# Altium project Limit_Switch_RGB_Vertical_v1.0.PrjPcb
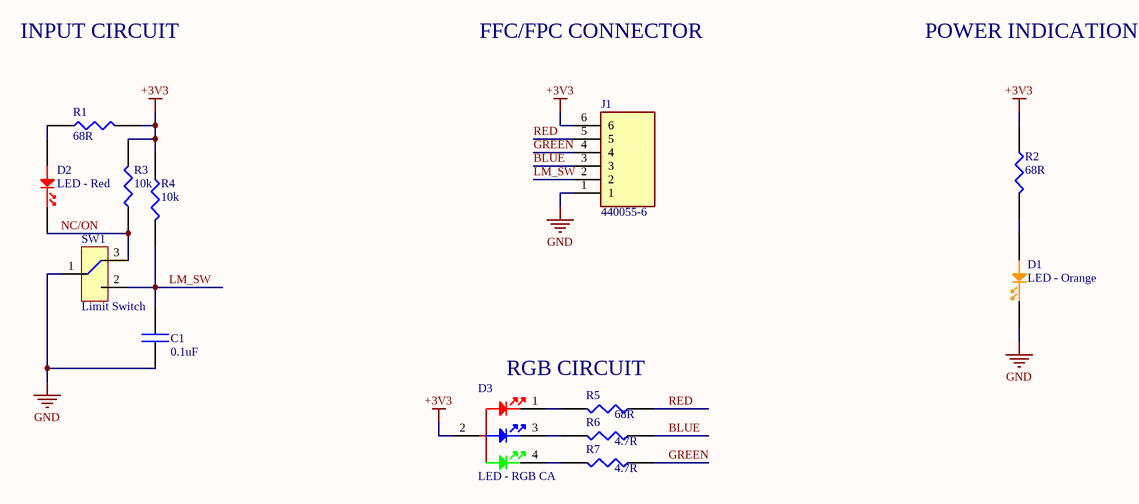
[diagram p0: Limit_Switch_RGB_Vertical_v1.0.SchDoc]
1 sheet, 13 parts. Net scope: global (net labels, ports and power ports of the same name join across sheets).
Board file: Limit_Switch_RGB_Vertical_v1.0.PcbDoc

## Sheet Limit_Switch_RGB_Vertical_v1.0.SchDoc
size A4

### Parts
C1  0.1uF  [0.1uF 0603]
D1  LED - Orange  [LED0603-Orange]
D2  LED - Red  [LED RED 0603]
D3  LED - RGB CA  [LED RGB CA 3528]
J1  440055-6  [TE_440055-6]
R1  68R  [68R 0603]
R2  68R  [68R 0603]
R3  10k  [10k R0603]
R4  10k  [10k R0603]
R5  68R  [68R 0603]
R6  4.7R  [4.7R 0603]
R7  4.7R  [4.7R 0603]
SW1  Limit Switch  [LimitSwitch Horizontal]

### Nets
+3V3: D3.2(Anode) J1.6 R1.2 R2.1 R3.2 R4.1
GND: C1.1 D1.1(Cathode) J1.1 SW1.1(C)
BLUE: J1.3 R6.1
GREEN: J1.4 R7.1
LM_SW: C1.2 J1.2 R4.2 SW1.2(NO)
NC/ON: D2.2(Cathode) R3.1 SW1.3(NC)
RED: J1.5 R5.1
NetD1_2: D1.2(Anode) R2.2
NetD2_1: D2.1(Anode) R1.1
NetD3_1: D3.1(Red) R5.2
NetD3_3: D3.3(Blue) R6.2
NetD3_4: D3.4(Green) R7.2

### Notes on the sheet
- INPUT CIRCUIT
- FFC/FPC CONNECTOR
- POWER INDICATION
- RGB CIRCUIT

### Library data of the parts
C1 = C0603C104M4RACTU: CAP CER 0.1UF 16V X7R 0603; Manufacturer: KEMET; Dielectric Material: Ceramic; Capacitance: 100nF; Tolerance: 20%; Supplier 1: Digi-Key; Supplier Part Number 1: 399-1099-1-ND; Manufacturer Part Number: C0603C104M4RACTU; RoHS: Yes; Category: Ceramic Capacitors; Stock 1: 114153; Pricing 1: 1=0.10000, 10=0.03100, 50=0.01720, 100=0.01400, 500=0.01002, 1000=0.00787 (USD); Mount: Surface Mount,PCB; Case/Package: 0603; Number of Pins: 2; Case Code (Metric): 1608; Case Code (Imperial): 0603; Min Operating Temperature: -55°C; Max Operating Temperature: 125°C; Package Quantity: 1; Voltage Rating: 16V; Packaging: Tape and Reel; Voltage Rating (DC): 16V; Dielectric: X7R; Termination: SMD/SMT; Length: 1.6mm; Height: 0.8mm; Width: 0.031inch; Thickness: 0.034inch; Lead Pitch: 0.7mm; Depth: 0.8mm; Radiation Hardening: No; REACH SVHC: No SVHC; ComponentLink1URL: https://datasheet.ciiva.com/18102/getdatasheetpartid-66190-18102310.pdf?src-supplier=Verical; ComponentLink1Description: https://datasheet.ciiva.com/18102/getdatasheetpartid-66190-18102310.pdf?src-supplier=Verical; ComponentLink2URL: https://datasheet.ciiva.com/7823/kem-c1002-x7r-smd-7823992.pdf?src-supplier=Element14; ComponentLink2Description: https://datasheet.ciiva.com/7823/kem-c1002-x7r-smd-7823992.pdf?src-supplier=Element14; ComponentLink3URL: https://datasheet.ciiva.com/7823/kem-c1002-x7r-smd-7823993.pdf?src-supplier=Element14; ComponentLink3Description: https://datasheet.ciiva.com/7823/kem-c1002-x7r-smd-7823993.pdf?src-supplier=Element14; ComponentLink4URL: https://datasheet.ciiva.com/14589/70095383-14589450.pdf?src-supplier=Allied+Electronics; ComponentLink4Description: https://datasheet.ciiva.com/14589/70095383-14589450.pdf?src-supplier=Allied+Electronics; ComponentLink5URL: https://datasheet.ciiva.com/18192/getdatasheetpartid-302288-18192716.pdf?src-supplier=Verical; ComponentLink5Description: https://datasheet.ciiva.com/18192/getdatasheetpartid-302288-18192716.pdf?src-supplier=Verical
D1 = LTST-C191KFKT: LED ORANGE CLEAR SMD; Manufacturer: Vishay Lite-On; Lens Color: Colorless; Wavelength: 611nm; Number of LEDs: 1; Viewing Angle: 130°; Lens Style: Diffused,Colorless,Rectangular; Luminous Intensity: 90mcd; Forward Current: 30mA; Forward Voltage: 2V; Power Rating: 75mW; Reverse Voltage: 5V; Dominant Wavelength: 605nm; Test Current: 20mA; Supplier 1: Digi-Key; Supplier Part Number 1: 160-1445-1-ND; Manufacturer Part Number: LTST-C191KFKT; RoHS: Yes; Category: LEDs; Stock 1: 92562; Pricing 1: 1=0.24000, 10=0.17900, 100=0.08460, 500=0.05640, 1000=0.04418, 2500=0.04324 (USD); Mount: Surface Mount; Case/Package: 0603; Number of Pins: 2; Case Code (Metric): 1608; Color: Orange; Case Code (Imperial): 0603; Min Operating Temperature: -55°C; Max Operating Temperature: 85°C; Package Quantity: 1; Packaging: Tape and Reel; Illumination Color: Orange; Lens Transparency: Clear; Number of Elements: 1; Power Dissipation: 75mW; Length: 1.6mm; Height: 0.55mm; Width: 0.8mm; Depth: 0.8mm; Radiation Hardening: No; Lead Free: Lead Free; ComponentLink1URL: https://datasheet.ciiva.com/2109/ltst-c191kfkt-2109968.pdf?src-supplier=Digi-Key; ComponentLink1Description: https://datasheet.ciiva.com/2109/ltst-c191kfkt-2109968.pdf?src-supplier=Digi-Key; ComponentLink2URL: https://datasheet.ciiva.com/12400/100-ltst-c191kfkt-39904-12400811.pdf?src-supplier=Mouser; ComponentLink2Description: https://datasheet.ciiva.com/12400/100-ltst-c191kfkt-39904-12400811.pdf?src-supplier=Mouser; ComponentLink3URL: https://datasheet.ciiva.com/11775/0900766b80dc02b0-11775613.pdf?src-supplier=RSComponents; ComponentLink3Description: https://datasheet.ciiva.com/11775/0900766b80dc02b0-11775613.pdf?src-supplier=RSComponents; ComponentLink4URL: https://datasheet.ciiva.com/15201/getdatasheetpartid-631075-15201391.pdf?src-supplier=Verical; ComponentLink4Description: https://datasheet.ciiva.com/15201/getdatasheetpartid-631075-15201391.pdf?src-supplier=Verical; ComponentLink5URL: https://datasheet.ciiva.com/2109/s-110-ltst-c191kfkt-2109969.pdf?src-supplier=Digi-Key; ComponentLink5Description: https://datasheet.ciiva.com/2109/s-110-ltst-c191kfkt-2109969.pdf?src-supplier=Digi-Key
D2 = LTST-C191KRKT: On a Reel of 5000, 2.4 V Red LED 1608 (0603) SMD, Lite-On LTST-C191KRKT; Manufacturer: Vishay Lite-On; Lens Color: Colorless; Power Rating: 75mW; Luminous Intensity: 54mcd; Viewing Angle: 130°; Forward Voltage: 2V; Lens Style: Clear,Diffused,Colorless,Rectangular; Forward Current: 30mA; Dominant Wavelength: 631nm; Test Current: 20mA; Lens Transparency: Clear; Number of Elements: 1; Wavelength: 639nm; Reverse Voltage: 5V; Supplier 1: Digi-Key; Supplier Part Number 1: 160-1447-1-ND; Manufacturer Part Number: LTST-C191KRKT; RoHS: Yes; Category: LEDs; Stock 1: 497234; Pricing 1: 1=0.26000, 10=0.19200, 100=0.09090, 500=0.06060, 1000=0.04747, 2500=0.04646 (USD); Mount: Surface Mount; Case/Package: 0603; Number of Pins: 2; Color: Red; Case Code (Metric): 1608; Case Code (Imperial): 0603; Min Operating Temperature: -55°C; Max Operating Temperature: 85°C; Packaging: Tape and Reel; Package Quantity: 1; Illumination Color: Red; Power Dissipation: 75mW; Number of LEDs: 1; Voltage: 2V; Length: 1.6mm; Height: 0.55mm; Width: 0.8mm; Depth: 0.8mm; Radiation Hardening: No; Lead Free: Lead Free; ComponentLink1URL: https://datasheet.ciiva.com/11773/0900766b80dc02b2-11773601.pdf?src-supplier=RSComponents; ComponentLink1Description: https://datasheet.ciiva.com/11773/0900766b80dc02b2-11773601.pdf?src-supplier=RSComponents; ComponentLink2URL: https://datasheet.ciiva.com/16212/ltst-c191krkt-16212419.pdf?src-supplier=Future+Electronics; ComponentLink2Description: https://datasheet.ciiva.com/16212/ltst-c191krkt-16212419.pdf?src-supplier=Future+Electronics; ComponentLink3URL: https://datasheet.ciiva.com/15117/getdatasheetpartid-141922-15117737.pdf?src-supplier=Verical; ComponentLink3Description: https://datasheet.ciiva.com/15117/getdatasheetpartid-141922-15117737.pdf?src-supplier=Verical; ComponentLink4URL: https://datasheet.ciiva.com/12400/lite-on-ltst-c191krkt-190135-12400910.pdf?src-supplier=Mouser; ComponentLink4Description: https://datasheet.ciiva.com/12400/lite-on-ltst-c191krkt-190135-12400910.pdf?src-supplier=Mouser; ComponentLink5URL: https://datasheet.ciiva.com/2109/s-110-ltst-c191krkt-2109970.pdf?src-supplier=Digi-Key; ComponentLink5Description: https://datasheet.ciiva.com/2109/s-110-ltst-c191krkt-2109970.pdf?src-supplier=Digi-Key; ComponentLink6URL: https://datasheet.ciiva.com/2109/s-110-ltst-c191krkt-2109971.pdf?src-supplier=Digi-Key; ComponentLink6Description: https://datasheet.ciiva.com/2109/s-110-ltst-c191krkt-2109971.pdf?src-supplier=Digi-Key; ComponentLink7URL: https://datasheet.ciiva.com/2109/s-110-ltst-c191krkt-2109972.pdf?src-supplier=Digi-Key; ComponentLink7Description: https://datasheet.ciiva.com/2109/s-110-ltst-c191krkt-2109972.pdf?src-supplier=Digi-Key
D3 = CLV1A-FKB-CK1VW1DE1BB7C3C3: Multicolor LED Red/Green/Blue 624nm/535nm/475nm 50mA/25mA/25mA 4-Pin SMD T/R; Manufacturer: Cree; Color: Blue,Green,Red; Lens Style: Round,Flat; Element Configuration: Common Anode; Luminous Intensity: 310mcd; Forward Voltage: 3.2V; Test Current: 20mA; Dominant Wavelength: 468nm; Supplier 1: Digi-Key; Supplier Part Number 1: CLV1A-FKB-CK1VW1DE1BB7C3C3CT-ND; Manufacturer Part Number: CLV1A-FKB-CK1VW1DE1BB7C3C3; RoHS: No; Category: LEDs; Stock 1: 95758; Pricing 1: 1=0.42000, 10=0.39500, 100=0.36480, 1000=0.32631 (USD); Mount: Surface Mount; Case/Package: PLCC; Number of Pins: 4; Packaging: Cut Tape; Length: 3.2mm; Height: 2.1mm; Width: 2.8mm; ComponentLink1URL: http://www.farnell.com/datasheets/2606189.pdf?src-supplier=Farnell; ComponentLink1Description: http://www.farnell.com/datasheets/2606189.pdf?src-supplier=Farnell; ComponentLink2URL: https://www.cree.com/led-components/media/documents/ds-CLV1A-FKB.pdf?src-supplier=Digi-Key; ComponentLink2Description: https://www.cree.com/led-components/media/documents/ds-CLV1A-FKB.pdf?src-supplier=Digi-Key
J1 = 440055-6: MF: {'manufacturer': 'TE Connectivity'}; Package: None; Value: *; Availability: Unavailable; MP: 440055-6; Price: None
R1 R2 R5 = CRGP0603F68R: CRGP 0603 68R 1%; Manufacturer: TE Connectivity; Max Power Dissipation: 250mW; Temperature Coefficient: 200ppm/°C; Supplier 1: Digi-Key; Supplier Part Number 1: A130402CT-ND; Manufacturer Part Number: CRGP0603F68R; RoHS: No; Category: Chip SMD Resistors; Stock 1: 49308; Pricing 1: 1=0.14000, 10=0.11400, 100=0.04470, 1000=0.01870, 2500=0.01714 (USD); Case/Package: 0603; Case Code (Imperial): 0603; Case Code (Metric): 1608; Min Operating Temperature: -55°C; Max Operating Temperature: 155°C; Resistor Type: Thick Film; Packaging: Tape and Reel; Resistance: 68R; Tolerance: 1%; Number of Terminations: 2; ComponentLink1URL: https://www.te.com/commerce/DocumentDelivery/DDEController?Action=srchrtrv&amp;DocNm=9-1773463-9&amp;DocType=DS&amp;DocLang=English&src-supplier=Digi-Key; ComponentLink1Description: https://www.te.com/commerce/DocumentDelivery/DDEController?Action=srchrtrv&amp;DocNm=9-1773463-9&amp;DocType=DS&amp;DocLang=English&src-supplier=Digi-Key
R3 R4 = CRG0603F10K/10: RES 10.0K OHM 1/10W 1% 0603; Manufacturer: TE Connectivity; Voltage Rating: 50V; Number of Resistors: 1; Resistance: 10kR; Power Rating: 100mW; Temperature Coefficient: 100ppm/°C; Supplier 1: Digi-Key; Supplier Part Number 1: A121523CT-ND; Manufacturer Part Number: CRG0603F10K/10; RoHS: Yes; Category: Chip SMD Resistors; Stock 1: 172089; Pricing 1: 1=0.10000, 10=0.03100, 100=0.01270, 1000=0.00570, 2500=0.00494, 5000=0.00409 (USD); Mount: Surface Mount; Case/Package: 0603; Weight: 7.1E-05oz; Case Code (Imperial): 0603; Min Operating Temperature: -55°C; Max Operating Temperature: 125°C; Resistor Type: Thick Film; Number of Terminations: 2; Termination: Solder; Packaging: Tape and Reel; Tolerance: 1%; Package Quantity: 10000; Max Power Dissipation: 100mW; Length: 1.6mm; Height: 0.022inch; Depth: 0.8mm; Width: 0.8mm; Radiation Hardening: No; Military Standard: Not; ELV: Compliant; ComponentLink1URL: https://datasheet.ciiva.com/2530/eng-cd-1622829-ba-2530062.pdf?src-supplier=Digi-Key; ComponentLink1Description: https://datasheet.ciiva.com/2530/eng-cd-1622829-ba-2530062.pdf?src-supplier=Digi-Key
R6 R7 = CRGCQ0603J4R7: Manufacturer: TE Connectivity; Supplier 1: Digi-Key; Supplier Part Number 1: A130077CT-ND; Manufacturer Part Number: CRGCQ0603J4R7; RoHS: No; Category: Chip SMD Resistors; Stock 1: 47068; Pricing 1: 1=0.10000, 10=0.01900, 100=0.00780, 1000=0.00352, 2500=0.00306 (USD)
SW1 = SS0750301F040P1A: Switch Snap Action N.O./N.C. SPDT Straight Lever 3A 250VAC 0.39N Thru-Hole PC Pins; Manufacturer: E-Switch; Mechanical Life: 1000000Cycles; Operating Force: 0.4N; Voltage Rating (AC): 125V; Switch Function: On-Mom; Electrical Life: 100000Cycles; Pretravel: 0.063inch; Operating Position: 0.345inch; Supplier 1: Digi-Key; Supplier Part Number 1: EG4924-ND; Manufacturer Part Number: SS0750301F040P1A; RoHS: Yes; Category: Snap Action / Limit Switches; Stock 1: 1941; Pricing 1: 1=1.09000, 10=1.02800, 25=0.98640, 50=0.94540, 100=0.90420, 250=0.71924, 500=0.65760, 1000=0.63705, 5000=0.57540 (USD); Mount: Through Hole; Min Operating Temperature: -25°C; Max Operating Temperature: 75°C; Current Rating: 3A; Package Quantity: 120; Packaging: Bulk; Termination: PC Pin; Throw Configuration: SPDT; ComponentLink1URL: https://datasheet.ciiva.com/2897/q971003c-2897801.pdf?src-supplier=Digi-Key; ComponentLink1Description: https://datasheet.ciiva.com/2897/q971003c-2897801.pdf?src-supplier=Digi-Key